# EasyEDA Pro project 限位开关板.eprj

# Schematic 原理图

## Sheets
1 主控MCU: Board Name: XZ转接板; Create Date: 2024-04-22; Page Name: 主控MCU; Project Name: 限位开关板; Schematic Name: 原理图; Update Date: 2025-05-19; Company: 嘉立创EDA; Page Size: A3; Version: V1.0
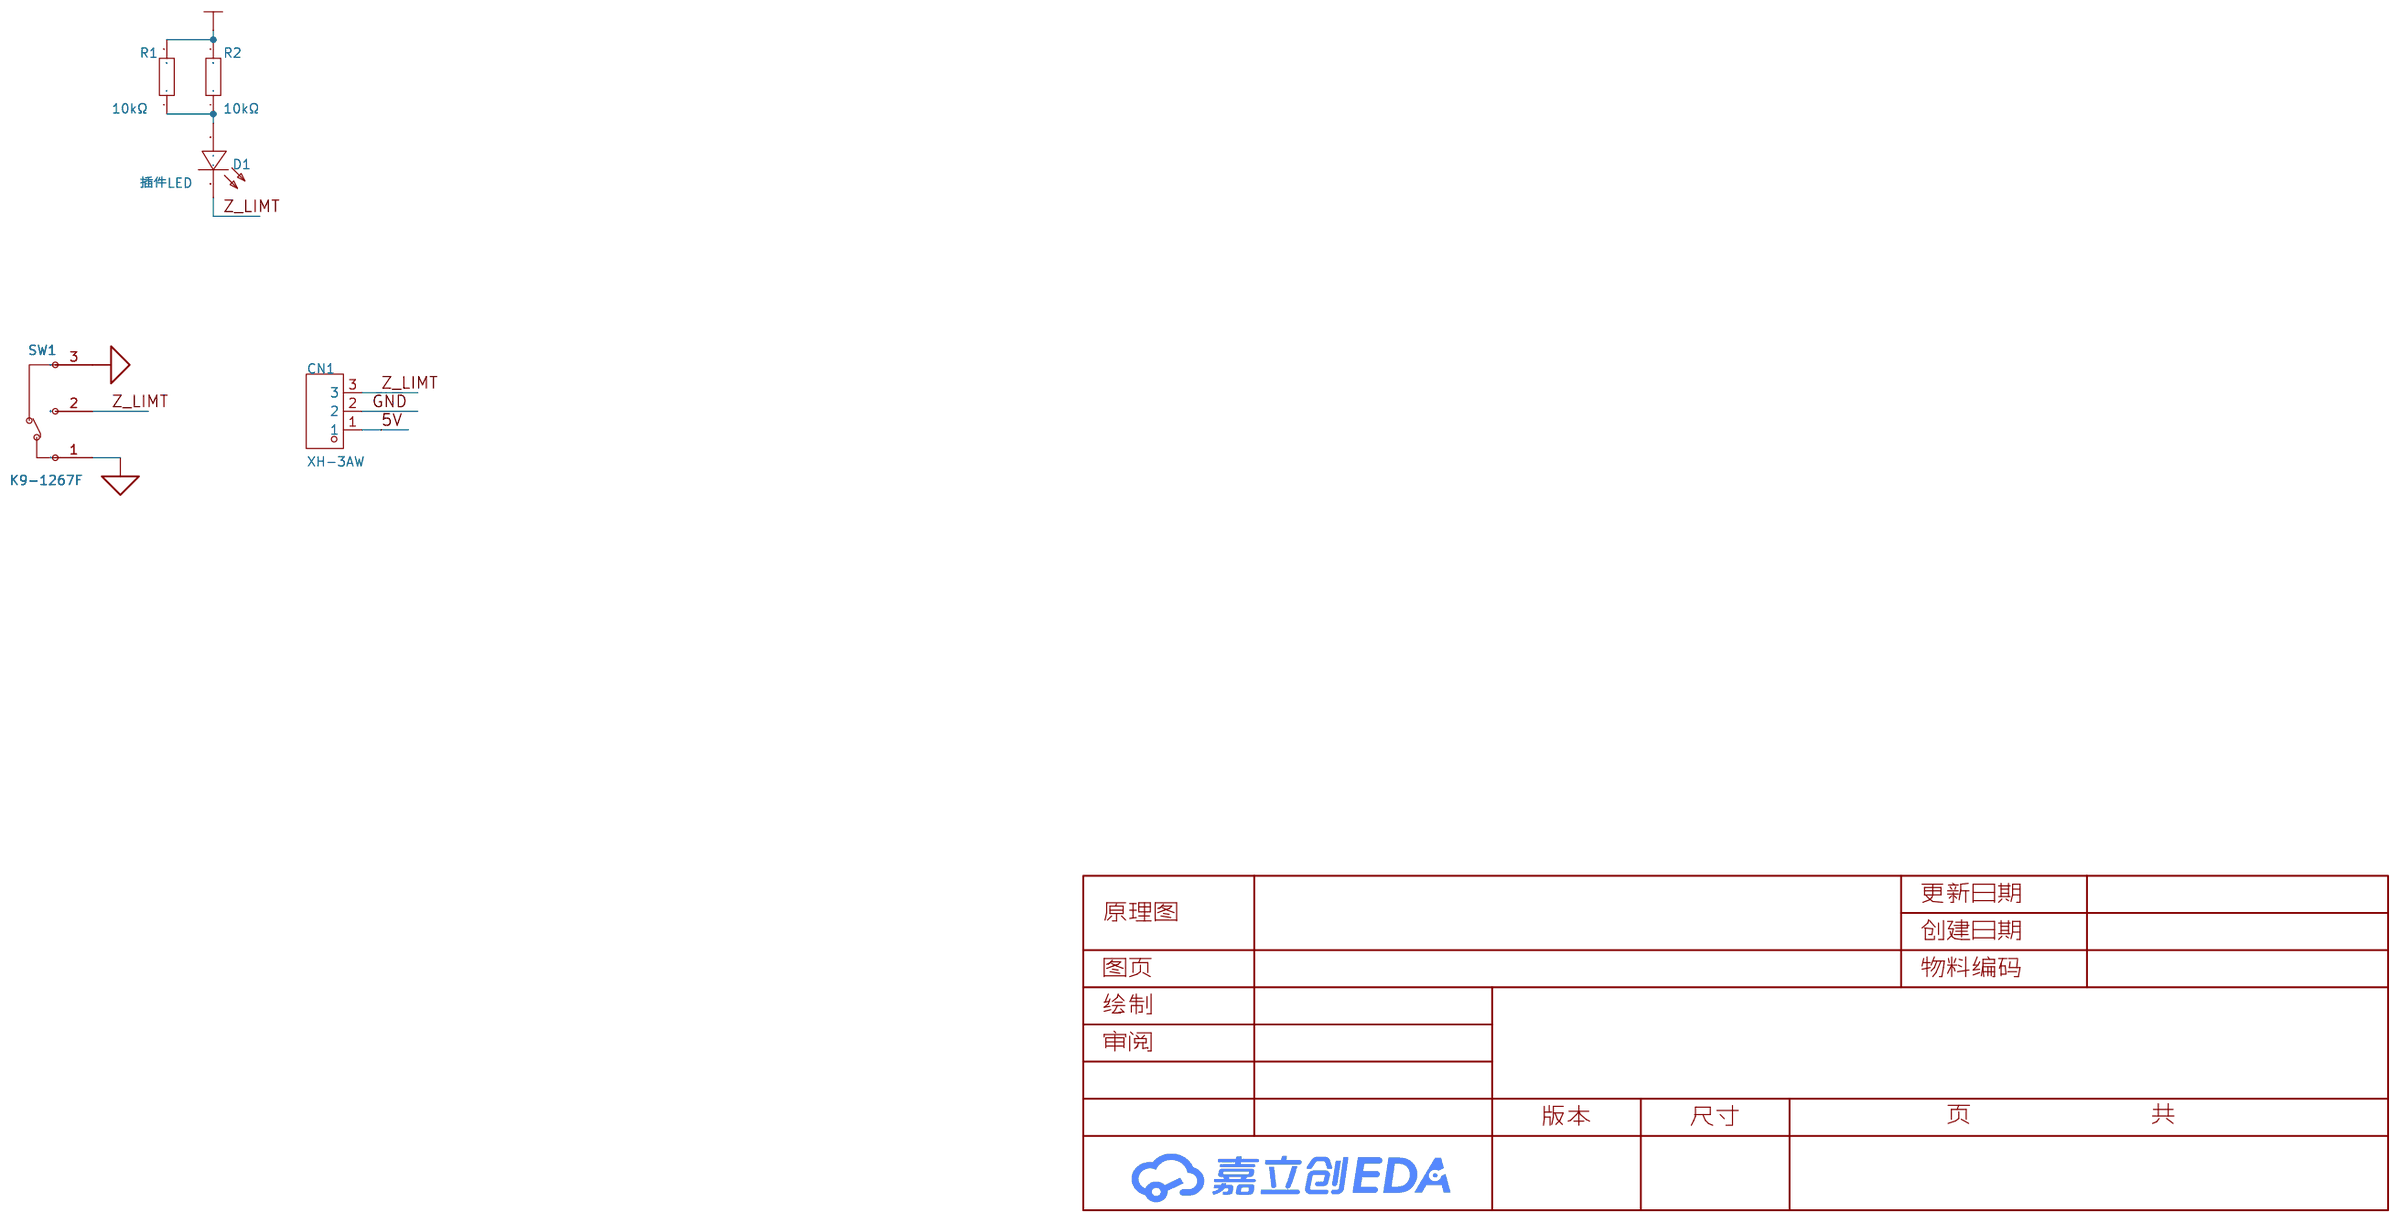
[diagram p0: 主控MCU]
2 电源及控制: Board Name: 转接隔离板; Create Date: 2024-12-30; Page Name: 电源及控制; Project Name: 延时继电器; Update Date: 2025-04-08
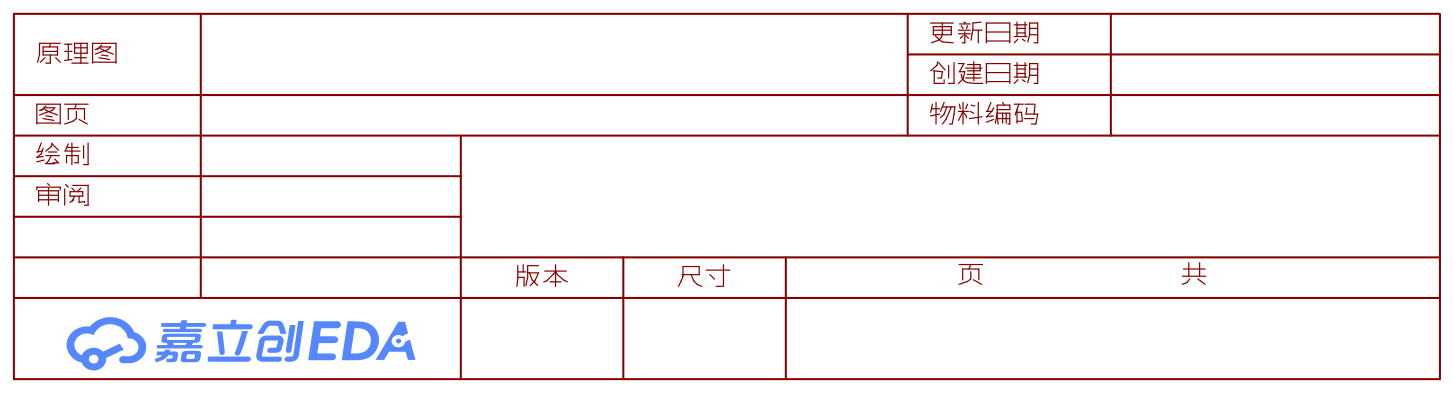
[diagram p1: 电源及控制]

## Parts
CN1  XH-3AW  [CONN-TH_3P-P2.50_XH-3A]
D1  插件LED  [LED-TH_BD3.8-P2.54-FD]
R1  10kΩ  [R0805]
R2  10kΩ  [R0805]
SW1  K9-1267F  [SW-TH_K9-1267F]

## Library data of the parts
CN1 = XH-3AW: LCSC Part Name: XH-3AW，3P，脚距2.5mm，卧插 卧插; Supplier Part: C18428; Manufacturer: BOOMELE(博穆精密); Supplier Footprint: 插件,P=2.5mm; JLCPCB Part Class: Extended Part; Datasheet: https://atta.szlcsc.com/upload/public/pdf/source/20151222/1457707638029.pdf; Supplier: LCSC; Reference Series: XH; Pitch: 2.5mm; Pins Structure: 1x3P; Number of Rows: 1; Number of PINs Per Row: 3
D1 = 204-10SURC/S530-A3-L: LCSC Part Name: 红灯; Supplier Part: C264302; Manufacturer: EVERLIGHT(台湾亿光); Supplier Footprint: 插件,D=3mm; JLCPCB Part Class: Extended Part; Datasheet: https://atta.szlcsc.com/upload/public/pdf/source/20181204/C264302_3C164FC09690301AE5D79DE2C4875559.pdf; Supplier: LCSC; Emitted Color: 红灯
R1 R2 = 0805W8F6803T5E: LCSC Part Name: 680kΩ ±1% 125mW; Supplier Part: C17797; Manufacturer: UNI-ROYAL(厚声); Supplier Footprint: 0805; JLCPCB Part Class: Basic Part; Datasheet: https://atta.szlcsc.com/upload/public/pdf/source/20200306/C422600_1E6D84923E4A46A82E41ADD87F860B5C.pdf; Supplier: LCSC; Type: 厚膜电阻; Tolerance: ±1%; Power(Watts): 125mW; Temperature Coefficient: ±100ppm/℃; Overload Voltage (Max): 150V; Operating Temperature Range: -55℃~+155℃
SW1 = K9-1267F: LCSC Part Name: 弧形压柄300万次寿命小微动 12.7mm*5.7mm; Supplier Part: C107263; Manufacturer: 韩国韩荣; Supplier Footprint: 插件; JLCPCB Part Class: Extended Part; Datasheet: https://atta.szlcsc.com/upload/public/pdf/source/20201214/C107263_D9656DE761E5BF43078859A56D7E33A8.pdf; Supplier: LCSC; Type: 微动开关; Contact Current (DC): 100mA; Voltage Rating (DC): 30V; Contact Current (AC): 1A; Voltage Rating (AC): 125V; Circuit: 单刀双掷; Mechanical Life: 3000000; Operating Temperature: -25℃~+85℃; Switch Length: 12.7mm; Switch Width: 5.7mm; Switch Height: 12.8mm

## Nets
5V: CN1.1 R1.2 R2.2
GND: CN1.2 SW1.1(C) SW1.3(NC)
Z_LIMT: CN1.3 D1.2(K) SW1.2(NO)
$1N79082: D1.1(A) R1.1 R2.1

# Board PCB
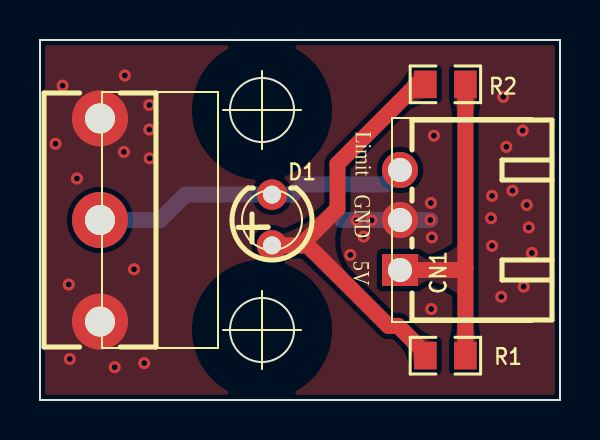
[diagram p2: board, top side]
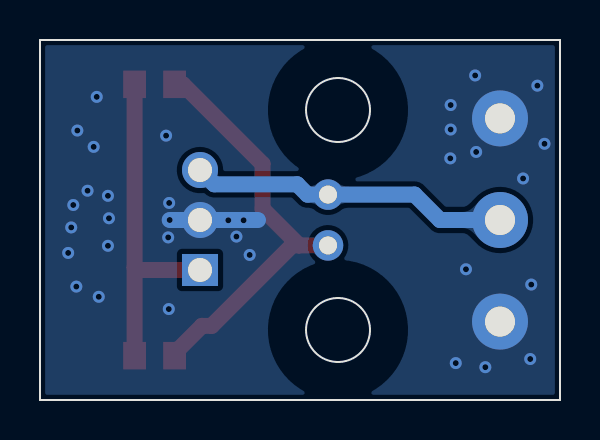
[diagram p3: board, bottom side, seen from below]

Outline 26 x 18 mm; copper layers: Top Layer, Bottom Layer. Coordinates in mm from the lower left corner of the outline.
Outline path: circle c11.1,14.5 r1.6 ; circle c11.1,3.5 r1.6 ; 0,18 26,18 26,0 0,0 0,18
Stack: Top Layer 0.035mm / Dielectric1 1.51mm FR4 er 4.5 / Bottom Layer 0.035mm

## Design rules (mm)
template: 用户自定义配置
spacing Default (default): track to track 0.152, other pairs 0 to 0.152
track width Default (default): min 0.254, default 0.254, max 25.4
differential pair differentialPair (default): width min 0.127, default 0.254, max 2.54; gap min 0.152, default 0.152
via Default (default): diameter min 0.25, default 0.61, max 100.025; hole min 0.2, default 0.305, max 59.995

## Placement (name value [footprint] x y rotation side)
CN1  XH-3AW  [CONN-TH_3P-P2.50_XH-3A]  18 9 90 top
D1  插件LED  [LED-TH_BD3.8-P2.54-FD]  11.6 9 90 top
R1  10kΩ  [R0805]  20.27 2.22 0 top
R2  10kΩ  [R0805]  20.27 15.78 0 top
SW1  K9-1267F  [SW-TH_K9-1267F]  3 9 90 top

## Footprints (pads in the part's own frame, mm; a bottom-side part is the same pattern mirrored in y, then rotated)
CONN-TH_3P-P2.50_XH-3A
  rect 1.6x1.801 hole 1.199: 1(-2.499,0)
  round 1.801 hole 1.199: 2(0,0) 3(2.499,0)
LED-TH_BD3.8-P2.54-FD
  round 1.524 hole 0.9: 1(-1.27,0) 2(1.27,0)
R0805
  rect 1.133x1.377 smd: 1(-1,0) 2(1,0)
SW-TH_K9-1267F
  round 2.799 hole 1.501: 1(-5.08,0) 2(0,0) 3(5.08,0)

## Nets
As in the schematic.

## Via types
v1: diameter 0.6, hole 0.3, Top Layer to Bottom Layer, 34 vias

## Routing (per net, layer and track width the routed paths; a pad name or vN(x,y) marks a point on that pad's centre or on a via; arc(x,y) is an arc through that point)
5V: length 16.9
  Top Layer w0.8: CN1.1 21.14,6.5 21.27,6.63 ; R2.2 21.27,6.63 ; 21.27,6.63 R1.2
GND: length 4.4
  Bottom Layer w0.8: v1(19.52,9) CN1.2 15.1,9
  vias: v1(0.78,12.81) v1(1.13,15.72) v1(1.44,5.77) v1(1.49,2.05) v1(1.85,11.08) v1(3.73,1.64) v1(4.24,16.23) v1(4.19,12.4) v1(4.7,6.54) v1(5.21,1.84) v1(5.47,14.75) v1(5.47,13.52) v1(5.49,12.08) v1(15.52,7.25) v1(15.82,8.98) v1(16.18,8.17) v1(16.59,8.98) v1(19.54,9.85) v1(19.56,4.55) v1(19.59,8.13) v1(19.7,13.22) v1(22.55,9.09) v1(22.6,10.21) v1(22.6,7.71) v1(23.06,5.16) v1(23.16,15.16) v1(23.32,12.66) v1(23.62,10.46) v1(24.13,13.47) v1(24.18,5.67) v1(24.34,9.75) v1(24.44,8.63) v1(24.59,7.35)
Z_LIMT: length 16
  Bottom Layer w0.8: CN1.3 17.29,10.79 13.14,10.79 12.62,10.27 D1.2 7.27,10.27 6,9 SW1.2
$1N79082: length 20.9
  Top Layer w0.8: 13.04,7.73 14.87,9.56 14.87,11.81 18.85,15.78 R2.1 ; 13.04,7.73 13.39,7.73 17.42,3.71 17.9,3.71 19.27,2.34 R1.1 ; 13.04,7.73 D1.1

## Copper pours and planes (outline as drawn; the poured copper is in the pictures)
GND on Top Layer: -0.58,18.44 26.45,18.44 26.45,-0.84 -0.58,-0.84
GND on Bottom Layer: -0.58,18.44 26.45,18.44 26.45,-0.28 -0.58,-0.28

Small or netless copper shapes (teardrops, artwork), in the pictures only: 8 on Top Layer, 6 on Bottom Layer

## Text on the board
Top Silkscreen Layer: 5V | GND | Limit
